# Altium schematic sheet Motor driver.SchDoc: Stepper Driver
size A4; DrawnBy: Nilesh Amarathunge; Revision: V1.0; SheetNumber: 3; SheetTotal: 4
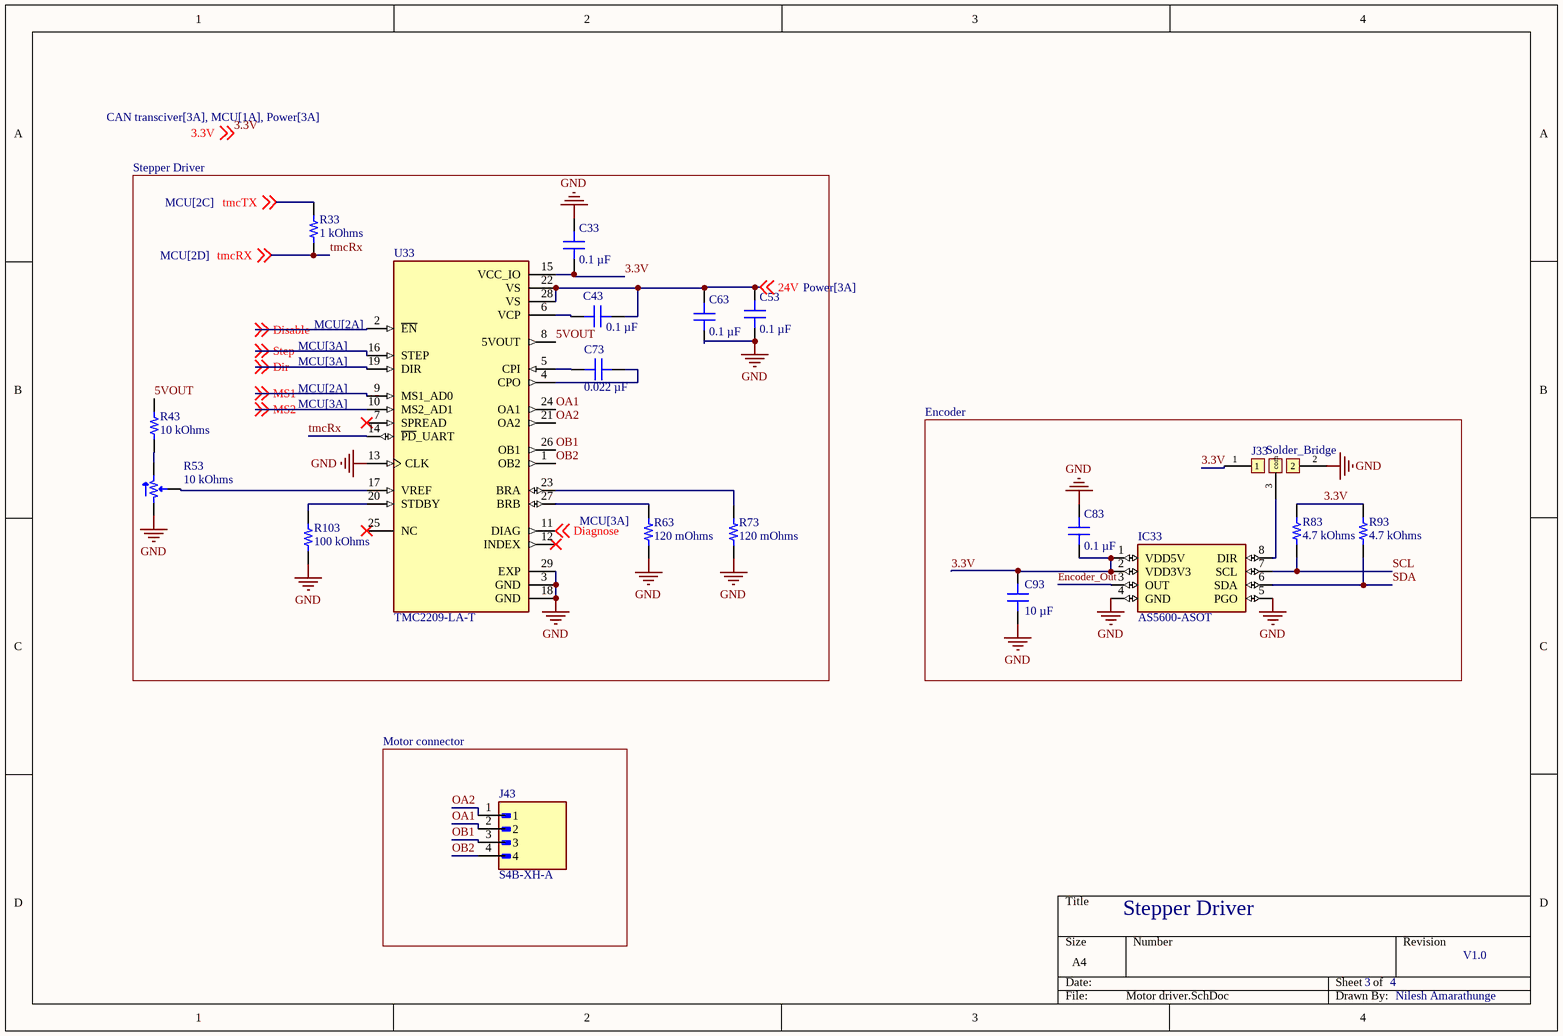
[diagram p0: Motor driver.SchDoc]

## Parts
C33  0.1 µF  [CAP 0805_2012]
C43  0.1 µF  [CAP 0805_2012]
C53  0.1 µF  [CAP 0805_2012]
C63  0.1 µF  [CAP 0805_2012]
C73  0.022 µF  [MURATA GRM21B 0805_2012]
C83  0.1 µF  [CAP 0805_2012]
C93  10 µF  [CAP 0805_2012]
IC33  AS5600-ASOT  [SOIC127P600X175-8N]
J33  Solder_Bridge  [Solder_Bridge]
J43  S4B-XH-A  [JST_S4B-XH-A]
R33  1 kOhms  [YAGEO RES 0805_2012]
R43  10 kOhms  [YAGEO RES 0805_2012]
R53  10 kOhms  [POT BOURNS TRIMPOT TC33]
R63  120 mOhms  [YAGEO RES 1206_3216]
R73  120 mOhms  [YAGEO RES 1206_3216]
R83  4.7 kOhms  [YAGEO RES 0805_2012]
R93  4.7 kOhms  [YAGEO RES 0805_2012]
R103  100 kOhms  [YAGEO RES 0805_2012]
U33  TMC2209-LA-T  [QFN50P500X500X90-29N]

## Blocks framed on the sheet
Stepper Driver: C33 C43 C53 C63 C73 R33 R43 R53 R63 R73 R103 U33
Encoder: C83 C93 IC33 J33 R83 R93
Motor connector: J43

## Nets
GND: C33.2 C53.1 C63.1 C83.2 C93.1 IC33.4(GND) IC33.5(PGO) J33.2 R53.1 R63.1 R73.1 R103.1 U33.3(GND) U33.13(CLK) U33.18(GND) U33.29(EXP)
3.3V: C33.1 C83.1 C93.2 IC33.1(VDD5V) IC33.2(VDD3V3) J33.1 R83.1 R93.1 U33.15(VCC_IO) ; off-sheet 3.3V
5VOUT: R43.2 U33.8(5VOUT)
24V: C43.1 C53.2 C63.2 U33.22(VS) U33.28(VS) ; off-sheet 24V
Diagnose: U33.11(DIAG) ; off-sheet Diagnose
Dir: U33.19(DIR) ; off-sheet Dir
Disable: U33.2(~{EN}) ; off-sheet Disable
Encoder_Out: IC33.3(OUT)
MS1: U33.9(MS1_AD0) ; off-sheet MS1
MS2: U33.10(MS2_AD1) ; off-sheet MS2
OA1: J43.2 U33.24(OA1)
OA2: J43.1 U33.21(OA2)
OB1: J43.3 U33.26(OB1)
OB2: J43.4 U33.1(OB2)
SCL: IC33.7(SCL) R83.2
SDA: IC33.6(SDA) R93.2
Step: U33.16(STEP) ; off-sheet Step
tmcRx: R33.1 U33.14(~{PD}_UART) ; off-sheet tmcRX
tmcTX: R33.2 ; off-sheet tmcTX
NetC43_2: C43.2 U33.6(VCP)
NetC73_1: C73.1 U33.5(CPI)
NetC73_2: C73.2 U33.4(CPO)
NetIC33_8: IC33.8(DIR) J33.3(com)
NetR43_1: R43.1 R53.3
NetR53_2: R53.2 U33.17(VREF)
NetR63_2: R63.2 U33.27(BRB)
NetR73_2: R73.2 U33.23(BRA)
NetR103_2: R103.2 U33.20(STDBY)

Not connected (* = marked no-connect by the designer): U33 7(SPREAD)* 12(INDEX)* 25(NC)*

## Library data of the parts
C33 C43 C53 C63 C83 = CC0805KRX7R9BB104: CAP CER 0.1UF 50V X7R 0805; manufacturer: Yageo; Tolerance: ±10%; Part Number: CC0805KRX7R9BB104; Capacitance: 0.1 µF; Applications: General Purpose; componentlink1description: Datasheet; componentlink1url: https://www.yageo.com/upload/media/product/productsearch/datasheet/mlcc/UPY-GPHC_X7R_6.3V-to-50V_18.pdf; componentlink2description: DigiKey Link; componentlink2url: https://www.digikey.com/en/products/detail/yageo/CC0805KRX7R9BB104/302874; Device Package: 0805 (2012 Metric); Features: High Voltage; lastupdated: 2024-02-09 8:15:42 PM; Lifecycle Status: Active; Minimum Order: 1; Mounting Type: Surface Mount, MLCC; Operating Temperature: -55°C ~ 125°C; Package / Case: 0805 (2012 Metric); packaging: TapeAndReel; partid: 12715; Part Status: Active; price: 0.01; series: CC; Size / Dimension: 0.079" L x 0.049" W (2.00mm x 1.25mm); Supplier 1: DigiKey; Supplier Part Number 1: 311-1140-1-ND; Temperature Coefficient: X7R; Thickness (Max): 0.033" (0.85mm); value: 0.1 µF; Voltage - Rated: 50V; LCSC part #: C49678; LCSC link: https://www.lcsc.com/product-detail/C49678.html
C73 = GRM21B5C1H223JA01L: CAP CER 0.022UF 50V C0G/NP0 0805; manufacturer: Murata Electronics; Temperature Coefficient: C0G, NP0; Tolerance: ±5%; Part Number: GRM21B5C1H223JA01L; Capacitance: 0.022 µF; Applications: General Purpose; componentlink1description: Datasheet; componentlink1url: https://search.murata.co.jp/Ceramy/image/img/A01X/G101/ENG/GRM21B5C1H223JA01-01.pdf; componentlink2description: DigiKey Link; componentlink2url: https://www.digikey.com/en/products/detail/murata-electronics/GRM21B5C1H223JA01L/586677; Device Package: 0805 (2012 Metric); lastupdated: 2024-08-27 9:29:56 AM; Lifecycle Status: Active; Minimum Order: 1; Mounting Type: Surface Mount, MLCC; Operating Temperature: -55°C ~ 125°C; Package / Case: 0805 (2012 Metric); packaging: TapeAndReel; partid: 7435; Part Status: Active; price: 0.06; series: GRM; Size / Dimension: 0.079" L x 0.049" W (2.00mm x 1.25mm); Supplier 1: DigiKey; Supplier Part Number 1: 490-1644-1-ND; Thickness (Max): 0.053" (1.35mm); value: 0.022 µF; Voltage - Rated: 50V; LCSC part #: C77069
C93 = CL21B106KPQNNNE: CAP CER 10UF 10V X7R 0805; manufacturer: Samsung Electro-Mechanics; Tolerance: ±10%; Part Number: CL21B106KPQNNNE; Capacitance: 10 µF; Applications: General Purpose; componentlink1description: Datasheet; componentlink1url: http://www.samsungsem.com/kr/support/product-search/mlcc/CL21B106KPQNNNE.jsp; componentlink2description: DigiKey Link; componentlink2url: https://www.digikey.com/en/products/detail/samsung-electro-mechanics/CL21B106KPQNNNE/3887422; Device Package: 0805 (2012 Metric); lastupdated: 2024-02-09 8:15:41 PM; Lifecycle Status: Active; Minimum Order: 1; Mounting Type: Surface Mount, MLCC; Operating Temperature: -55°C ~ 125°C; Package / Case: 0805 (2012 Metric); packaging: TapeAndReel; partid: 13130; Part Status: Active; price: 0.02; series: CL; Size / Dimension: 0.079" L x 0.049" W (2.00mm x 1.25mm); Supplier 1: DigiKey; Supplier Part Number 1: 1276-1764-1-ND; Temperature Coefficient: X7R; Thickness (Max): 0.055" (1.40mm); value: 10 µF; Voltage - Rated: 10V; LCSC part #: C32635; LCSC link: https://www.lcsc.com/product-detail/C32635.html
IC33 = AS5600-ASOT: Hall Effect Sensor Angle External Magnet, Not Included Gull Wing; MF: ams; SnapEDA_Link: https://www.snapeda.com/parts/AS5600-ASOT/ams/view-part/?ref=snap; Package: SOIC-8 ams; Value: *; MP: AS5600-ASOT; Check_prices: https://www.snapeda.com/parts/AS5600-ASOT/ams/view-part/?ref=eda; LCSC part #: C499458
R33 = SR0805JR-7W1KL: RES 1K OHM 5% 1/4W 0805; Manufacturer: Yageo; Power (Watts): 0.25W, 1/4W; Temperature Coefficient: ±100ppm/°C; Part Number: SR0805JR-7W1KL; Value: 1 kOhms; ComponentLink1Description: Datasheet; ComponentLink1URL: http://www.yageo.com/documents/recent/PYu-SR_20105_RoHS_L_8.pdf; ComponentLink2Description: DigiKey Link; ComponentLink2URL: https://www.digikey.com/en/products/detail/yageo/SR0805JR-7W1KL/9696409; Composition: Thick Film; Device Package: 0805 (2012 Metric); Features: Automotive AEC-Q200, Pulse Withstanding; Height - Seated (Max): 0.024" (0.60mm); LastUpdated: 2026-04-05 9:18:17 PM; Lifecycle Status: Active; Minimum Order: 1; Number of Terminations: 2; Operating Temperature: -55°C ~ 155°C; Package / Case: 0805 (2012 Metric); Packaging: TapeAndReel; PartId: 30716; Part Status: Active; Price: 0.02; Ratings: AEC-Q200; Resistance: 1 kOhms; Series: SR; Size / Dimension: 0.079" L x 0.049" W (2.00mm x 1.25mm); Supplier 1: DigiKey; Supplier Part Number 1: YAG6171CT-ND; Supplier Device Package: 0805; Tolerance: ±5%; LCSC part #: C441981
R43 = RC0805FR-0710KL: RES 10K OHM 1% 1/8W 0805; Manufacturer: Yageo; Power (Watts): 0.125W, 1/8W; Temperature Coefficient: ±100ppm/°C; Part Number: RC0805FR-0710KL; Value: 10 kOhms; ComponentLink1Description: Datasheet; ComponentLink1URL: https://www.yageo.com/upload/media/product/productsearch/datasheet/rchip/PYu-RC_Group_51_RoHS_L_10.pdf; ComponentLink2Description: DigiKey Link; ComponentLink2URL: https://www.digikey.com/en/products/detail/yageo/RC0805FR-0710KL/727535; Composition: Thick Film; Device Package: 0805 (2012 Metric); Features: Moisture Resistant; Height - Seated (Max): 0.024" (0.60mm); LastUpdated: 2024-07-25 9:20:18 AM; Lifecycle Status: Active; Minimum Order: 1; Number of Terminations: 2; Operating Temperature: -55°C ~ 155°C; Package / Case: 0805 (2012 Metric); Packaging: TapeAndReel; PartId: 46046; Part Status: Active; Price: 0.01; Resistance: 10 kOhms; Series: RC_L; Size / Dimension: 0.079" L x 0.049" W (2.00mm x 1.25mm); Supplier 1: DigiKey; Supplier Part Number 1: 311-10.0KCRCT-ND; Supplier Device Package: 0805; Tolerance: ±1%; LCSC part #: C84376; ComponentLink3Description: LCSC link; ComponentLink3URL: https://www.lcsc.com/product-detail/C84376.html?s_z=n_RC0805FR-0710KL%2520
R53 = TC33X-2-103E: TRIMMER 10K OHM 0.15W J LEAD TOP; Manufacturer: Bourns Inc.; Adjustment Type: Top Adjustment; Number of Turns: 1; Resistive Material: Cermet; Temperature Coefficient: ±250ppm/°C; Tolerance: ±25%; Part Number: TC33X-2-103E; ComponentLink1Description: Datasheet; ComponentLink1URL: https://www.bourns.com/docs/Product-Datasheets/TC33.pdf; ComponentLink2Description: DigiKey Link; ComponentLink2URL: https://www.digikey.com/en/products/detail/bourns-inc/TC33X-2-103E/612858; LastUpdated: 2024-06-03 8:01:52 PM; Lifecycle Status: Active; Minimum Order: 1; Mounting Type: Surface Mount; Packaging: TapeAndReel; PartId: 8; Part Status: Active; Power (Watts): 0.15W; Price: 0.11; Resistance: 10 kOhms; Series: Trimpot® TC33 - Open Frame; Size / Dimension: Rectangular - 0.150" x 0.142" Face (3.80mm x 3.60mm); Supplier 1: DigiKey; Supplier Part Number 1: TC33X-103ECT-ND; Termination Style: J Lead; Value: 10 kOhms; LCSC part #: C719176
R63 R73 = PE1206FRF470R12L: RES 0.12 OHM 1% 1W 1206; Manufacturer: Yageo; Temperature Coefficient: ±100ppm/°C; Part Number: PE1206FRF470R12L; ComponentLink1Description: Datasheet; ComponentLink1URL: https://www.yageo.com/upload/media/product/productsearch/datasheet/rchip/PYu-PE_521_RoHS_L_10.pdf; ComponentLink2Description: DigiKey Link; ComponentLink2URL: https://www.digikey.com/en/products/detail/yageo/PE1206FRF470R12L/16642038; Composition: Metal Film; Device Package: 1206 (3216 Metric); Features: Automotive AEC-Q200, Current Sense; Height - Seated (Max): 0.035" (0.89mm); LastUpdated: 2024-07-25 9:21:19 AM; Lifecycle Status: Active; Minimum Order: 1; Number of Terminations: 2; Operating Temperature: -55°C ~ 170°C; Package / Case: 1206 (3216 Metric); Packaging: TapeAndReel; PartId: 72617; Part Status: Active; Power (Watts): 1W; Price: 0.09; Ratings: AEC-Q200; Resistance: 120 mOhms; Series: PE_L; Size / Dimension: 0.126" L x 0.063" W (3.20mm x 1.60mm); Supplier 1: DigiKey; Supplier Part Number 1: 13-PE1206FRF470R12LCT-ND; Supplier Device Package: 1206; Tolerance: ±1%; Value: 120 mOhms; LCSC part #: C6356569
R83 R93 = RT0805BRD074K7L: RES SMD 4.7K OHM 0.1% 1/8W 0805; Manufacturer: Yageo; Power (Watts): 0.125W, 1/8W; Temperature Coefficient: ±25ppm/°C; Part Number: RT0805BRD074K7L; Value: 4.7 kOhms; ComponentLink1Description: Datasheet; ComponentLink1URL: https://www.yageo.com/upload/media/product/productsearch/datasheet/rchip/PYu-RT_1-to-0.01_RoHS_L_11.pdf; ComponentLink2Description: DigiKey Link; ComponentLink2URL: https://www.digikey.com/en/products/detail/yageo/RT0805BRD074K7L/1075937; Composition: Thin Film; Device Package: 0805 (2012 Metric); Height - Seated (Max): 0.024" (0.60mm); LastUpdated: 2024-07-25 9:20:24 AM; Lifecycle Status: Active; Minimum Order: 1; Number of Terminations: 2; Operating Temperature: -55°C ~ 155°C; Package / Case: 0805 (2012 Metric); Packaging: TapeAndReel; PartId: 36704; Part Status: Active; Price: 0.04; Resistance: 4.7 kOhms; Series: RT; Size / Dimension: 0.079" L x 0.049" W (2.00mm x 1.25mm); Supplier 1: DigiKey; Supplier Part Number 1: YAG1919CT-ND; Supplier Device Package: 0805; Tolerance: ±0.1%; LCSC part #: C865532
R103 = RT0805BRD07160KL: RES SMD 100K OHM 0.1% 1/8W 0805; Manufacturer: Yageo; Power (Watts): 0.125W, 1/8W; Resistance: 160 kOhms; Temperature Coefficient: ±25ppm/°C; Part Number: RT0805BRD07160KL; Value: 100 kOhms; ComponentLink1Description: Datasheet; ComponentLink1URL: https://www.yageo.com/upload/media/product/productsearch/datasheet/rchip/PYu-RT_1-to-0.01_RoHS_L_11.pdf; ComponentLink2Description: DigiKey Link; ComponentLink2URL: https://www.digikey.com/en/products/detail/yageo/RT0805BRD07160KL/1075623; Composition: Thin Film; Device Package: 0805 (2012 Metric); Height - Seated (Max): 0.024" (0.60mm); LastUpdated: 2024-07-25 9:20:21 AM; Lifecycle Status: Active; Minimum Order: 1; Number of Terminations: 2; Operating Temperature: -55°C ~ 155°C; Package / Case: 0805 (2012 Metric); Packaging: TapeAndReel; PartId: 40673; Part Status: Active; Price: 0.04; Series: RT; Size / Dimension: 0.079" L x 0.049" W (2.00mm x 1.25mm); Supplier 1: DigiKey; Supplier Part Number 1: YAG1788CT-ND; Supplier Device Package: 0805; Tolerance: ±0.1%; LCSC part #: C122537; ComponentLink3Description: LCSC link; ComponentLink3URL: https://www.lcsc.com/product-detail/C865212.html?s_z=n_RT0805BRD07160KL
U33 = TMC2209-LA-T: Bipolar Motor Driver Power MOSFET Step/Direction, UART 28-QFN (5x5); MF: Trinamic Motion Control GmbH; SnapEDA_Link: https://www.snapeda.com/parts/TMC2209-LA-T/Trinamic/view-part/?ref=snap; Package: VFQFN-28 Trinamic; Value: *; MP: TMC2209-LA-T; Check_prices: https://www.snapeda.com/parts/TMC2209-LA-T/Trinamic/view-part/?ref=eda; LCSC part #: C2150710
J43 = S4B-XH-A: Package: None; Price: None; Value: *; MP: S4B-XH-A; Availability: Unavailable; LCSC part #: C19271397